# Altium schematic sheet H-Bridge using MOSFET.SchDoc
size A4
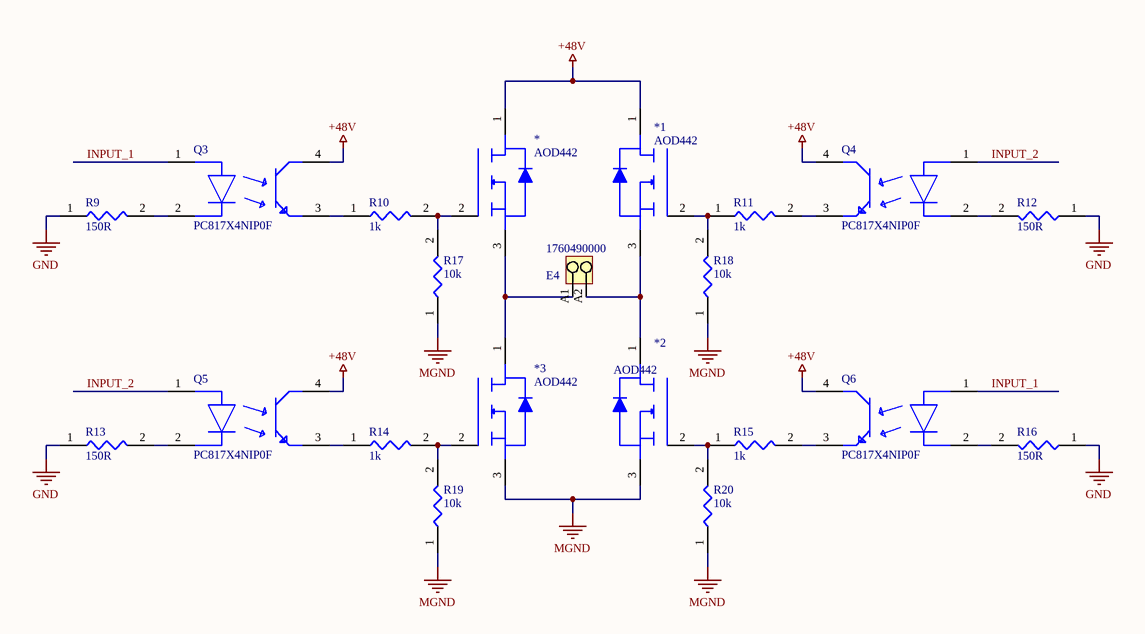
[diagram p0: H-Bridge using MOSFET.SchDoc]

## Parts
*  AOD442
*1  AOD442
*2  AOD442
*3  AOD442
E4  1760490000  [PM_5_08_90_02]
Q3  PC817X4NIP0F  [FP-PC817X4NIP0F-MFG]
Q4  PC817X4NIP0F  [FP-PC817X4NIP0F-MFG]
Q5  PC817X4NIP0F  [FP-PC817X4NIP0F-MFG]
Q6  PC817X4NIP0F  [FP-PC817X4NIP0F-MFG]
R9  150R  [R0603 1k]
R10  1k  [R0603 1k]
R11  1k  [R0603 1k]
R12  150R  [R0603 1k]
R13  150R  [R0603 1k]
R14  1k  [R0603 1k]
R15  1k  [R0603 1k]
R16  150R  [R0603 1k]
R17  10k  [R0603 1k]
R18  10k  [R0603 1k]
R19  10k  [R0603 1k]
R20  10k  [R0603 1k]

## Nets
+48V: *.1 *1.1 Q3.4(C) Q4.4(C) Q5.4(C) Q6.4(C)
GND: R9.1 R12.1 R13.1 R16.1
MGND: *2.3 *3.3 R17.1 R18.1 R19.1 R20.1
INPUT_1: Q3.1(A) Q6.1(A)
INPUT_2: Q4.1(A) Q5.1(A)
Net*1_2: *1.2 R11.1 R18.2
Net*1_3: *1.3 *2.1 E4.A2
Net*2_2: *2.2 R15.1 R20.2
Net*3_2: *3.2 R14.2 R19.2
Net*_2: *.2 R10.2 R17.2
Net*_3: *.3 *3.1 E4.A1
NetQ3_2: Q3.2(C) R9.2
NetQ3_3: Q3.3(E) R10.1
NetQ4_2: Q4.2(C) R12.2
NetQ4_3: Q4.3(E) R11.2
NetQ5_2: Q5.2(C) R13.2
NetQ5_3: Q5.3(E) R14.1
NetQ6_2: Q6.2(C) R16.2
NetQ6_3: Q6.3(E) R15.2

## Library data of the parts
E4 = CMP-1559-01627-1: OMNIMATE Signal - series PM; Manufacturer: Weidmueller; Contact_surface: tinned; Pitch_mm: 5,08 mm; Solid_min_H05_07_V_U: 0,13 mm²; Wire_cross_section_AWG_min_UL_1059: AWG 26; Wire_cross_section_AWG_max_UL_1059: AWG 14; Rated_voltage_for_surge_voltage_class_pollution_degree_II_2: 600 V; Rated_current_use_group_B_UL_1059: 15 A; Mounting_onto_the_PCB: Solder connection; Solder_pin_length_mm: 3,5 mm; Side_termination_characteristic: closed side; Contact_material: Cu-Leg; Pitch_inch: 0,2 inch; No_of_poles: 2; UL_94_flammability_rating: V-0; Insulating_material: Wemid (PA); Rated_voltage_use_group_B_UL_1059: 300 V; Solid_max_H05_07_V_U: 2,5 mm²; Short_text_for_material: PM 5.08/02/90 3.5SN OR BX; Revision: V1; PartNumber: 1760490000; Qty: 500 PCS; ComponentLink2Description: URL Link1; Packaging: Box; PackageReference: PM_5_08_90_02; ComponentLink2URL: http://catalog.weidmueller.com/catalog/Start.do?localeId=en&ObjectID=1760490000; Colour: Orange; ComponentLink1Description: Manufacturer URL; ComponentLink1URL: http://www.weidmueller.com/
Q3-Q6 = CMP-65434-000001-1: OPTOISOLATOR 5KV TRANS 4SMD; Manufacturer: Sharp; Collector Emitter Voltage: 80V; Standoff Height: 0.1mm; Power Dissipation: 200mW; Min Current Transfer Ratio: 50%; Reverse Voltage: 6V; Forward Current: 20mA; Forward Voltage: 1.2V; Max Current Transfer Ratio: 600%; Isolation Voltage: 5kVrms; Mouser Description: Transistor Output Optocouplers Photocoupler 300-600% CRT; RoHS: TRUE; ComponentLink2URL: https://www.sharpsde.com/fileadmin/products/Optoelectronics/Isolation%20Devices/Specs%20Photocoupler/PC817XxNIP0F_17Jun08_Spec_ED-04P129A.pdf; Lead Free: Yes; Device Class L1: Optoelectronics; ComponentLink2Description: Datasheet; Device Class L2: Optocouplers; Temperature: -30°C to +100°C; Temperature Range Low: -30°C; Automotive: No; Temperature Range High: +100°C; Octopart: https://octopart.com/pc817x4nip0f-sharp-20650453; Height: 4.6mm; Digikey Description: OPTOISOLATOR 5KV TRANS 4SMD; Category: Trans; Device Class L3: unset; Package: PC817X4NIP0F; Manufacturer Part Number: PC817X4NIP0F; Emiiter Collector Voltage: 6V
R9-R20 = CRGCQ0603F1K0: 0603 1k Ohm 1% 1/10W; Manufacturer: TE Connectivity; Resistance: 1kR; Max Power Dissipation: 100mW; Temperature Coefficient: 100ppm/°C; Supplier 1: Digi-Key; Supplier Part Number 1: A129688CT-ND; Manufacturer Part Number: CRGCQ0603F1K0; RoHS: No; Category: Chip SMD Resistors; Stock 1: 37973; Pricing 1: 1=0.10000, 10=0.02700, 100=0.01090, 1000=0.00490, 2500=0.00426 (USD); Case/Package: 0603; Case Code (Imperial): 0603; Case Code (Metric): 1608; Min Operating Temperature: -55°C; Max Operating Temperature: 155°C; Resistor Type: Thick Film; Features: Moisture Resistant,Automotive AEC-Q200; Packaging: Cut Tape; Tolerance: 1%; Number of Terminations: 2; ComponentLink1URL: https://www.te.com/commerce/DocumentDelivery/DDEController?Action=srchrtrv&DocNm=1773204-3&DocType=DS&DocLang=English&src-supplier=Digi-Key; ComponentLink1Description: https://www.te.com/commerce/DocumentDelivery/DDEController?Action=srchrtrv&DocNm=1773204-3&DocType=DS&DocLang=English&src-supplier=Digi-Key; ComponentLink2URL: https://4donline.ihs.com/images/VipMasterIC/IC/TYEL/TYEL-S-A0004929575/TYEL-S-A0004929575-1.pdf?hkey=52A5661711E402568146F3353EA87419&src-supplier=Farnell; ComponentLink2Description: https://4donline.ihs.com/images/VipMasterIC/IC/TYEL/TYEL-S-A0004929575/TYEL-S-A0004929575-1.pdf?hkey=52A5661711E402568146F3353EA87419&src-supplier=Farnell; ComponentLink3URL: https://www.te.com/commerce/DocumentDelivery/DDEController?Action=srchrtrv&amp;DocNm=1773204-3&amp;DocType=DS&amp;DocLang=English&src-supplier=Digi-Key; ComponentLink3Description: https://www.te.com/commerce/DocumentDelivery/DDEController?Action=srchrtrv&amp;DocNm=1773204-3&amp;DocType=DS&amp;DocLang=English&src-supplier=Digi-Key; ComponentLink4URL: https://4donline.ihs.com/images/VipMasterIC/IC/TYEL/TYEL-S-A0004929575/TYEL-S-A0004929575-1.pdf?hkey=52A5661711E402568146F3353EA87419&src-supplier=Element14; ComponentLink4Description: https://4donline.ihs.com/images/VipMasterIC/IC/TYEL/TYEL-S-A0004929575/TYEL-S-A0004929575-1.pdf?hkey=52A5661711E402568146F3353EA87419&src-supplier=Element14; ComponentLink5URL: https://4donline.ihs.com/images/VipMasterIC/IC/TYEL/TYEL-S-A0004929575/TYEL-S-A0004929575-1.pdf?hkey=52A5661711E402568146F3353EA87419&src-supplier=Newark; ComponentLink5Description: https://4donline.ihs.com/images/VipMasterIC/IC/TYEL/TYEL-S-A0004929575/TYEL-S-A0004929575-1.pdf?hkey=52A5661711E402568146F3353EA87419&src-supplier=Newark